# Altium project PCB_Project1.PrjPCB
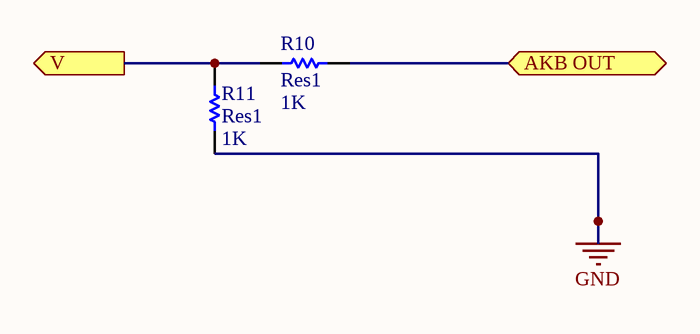
[diagram p0: voltmeter.SchDoc]
2 sheets, 2 parts. Net scope: flat (ports and power ports of the same name join across sheets).
Board file: PCB1.PcbDoc
Sheets:
  Sheet1.SchDoc
  voltmeter.SchDoc

## Sheet Sheet1.SchDoc
size A4

## Sheet voltmeter.SchDoc
size A4

### Parts
R10  Res1  value 1K  [AXIAL-0.3]
R11  Res1  value 1K  [AXIAL-0.3]

### Ports
AKB OUT, V (out)

### Nets
GND: R11.1
NetR10_1: R10.1 R11.2 ; port V
NetR10_2: R10.2 ; port AKB OUT

### Library data of the parts
R10 R11 = Res1: Resistor; Published: 8-Jun-2000; LatestRevisionDate: 17-Jul-2002; LatestRevisionNote: Re-released for DXP Platform.; PackageReference: AXIAL-0.3; Publisher: Altium Limited; PackageDescription: Axial Device, Thru-Hole; 2 Leads; 0.3 in Pin Spacing